# EAGLE design kinesisBLE V5 (EAGLE 9.6.2)
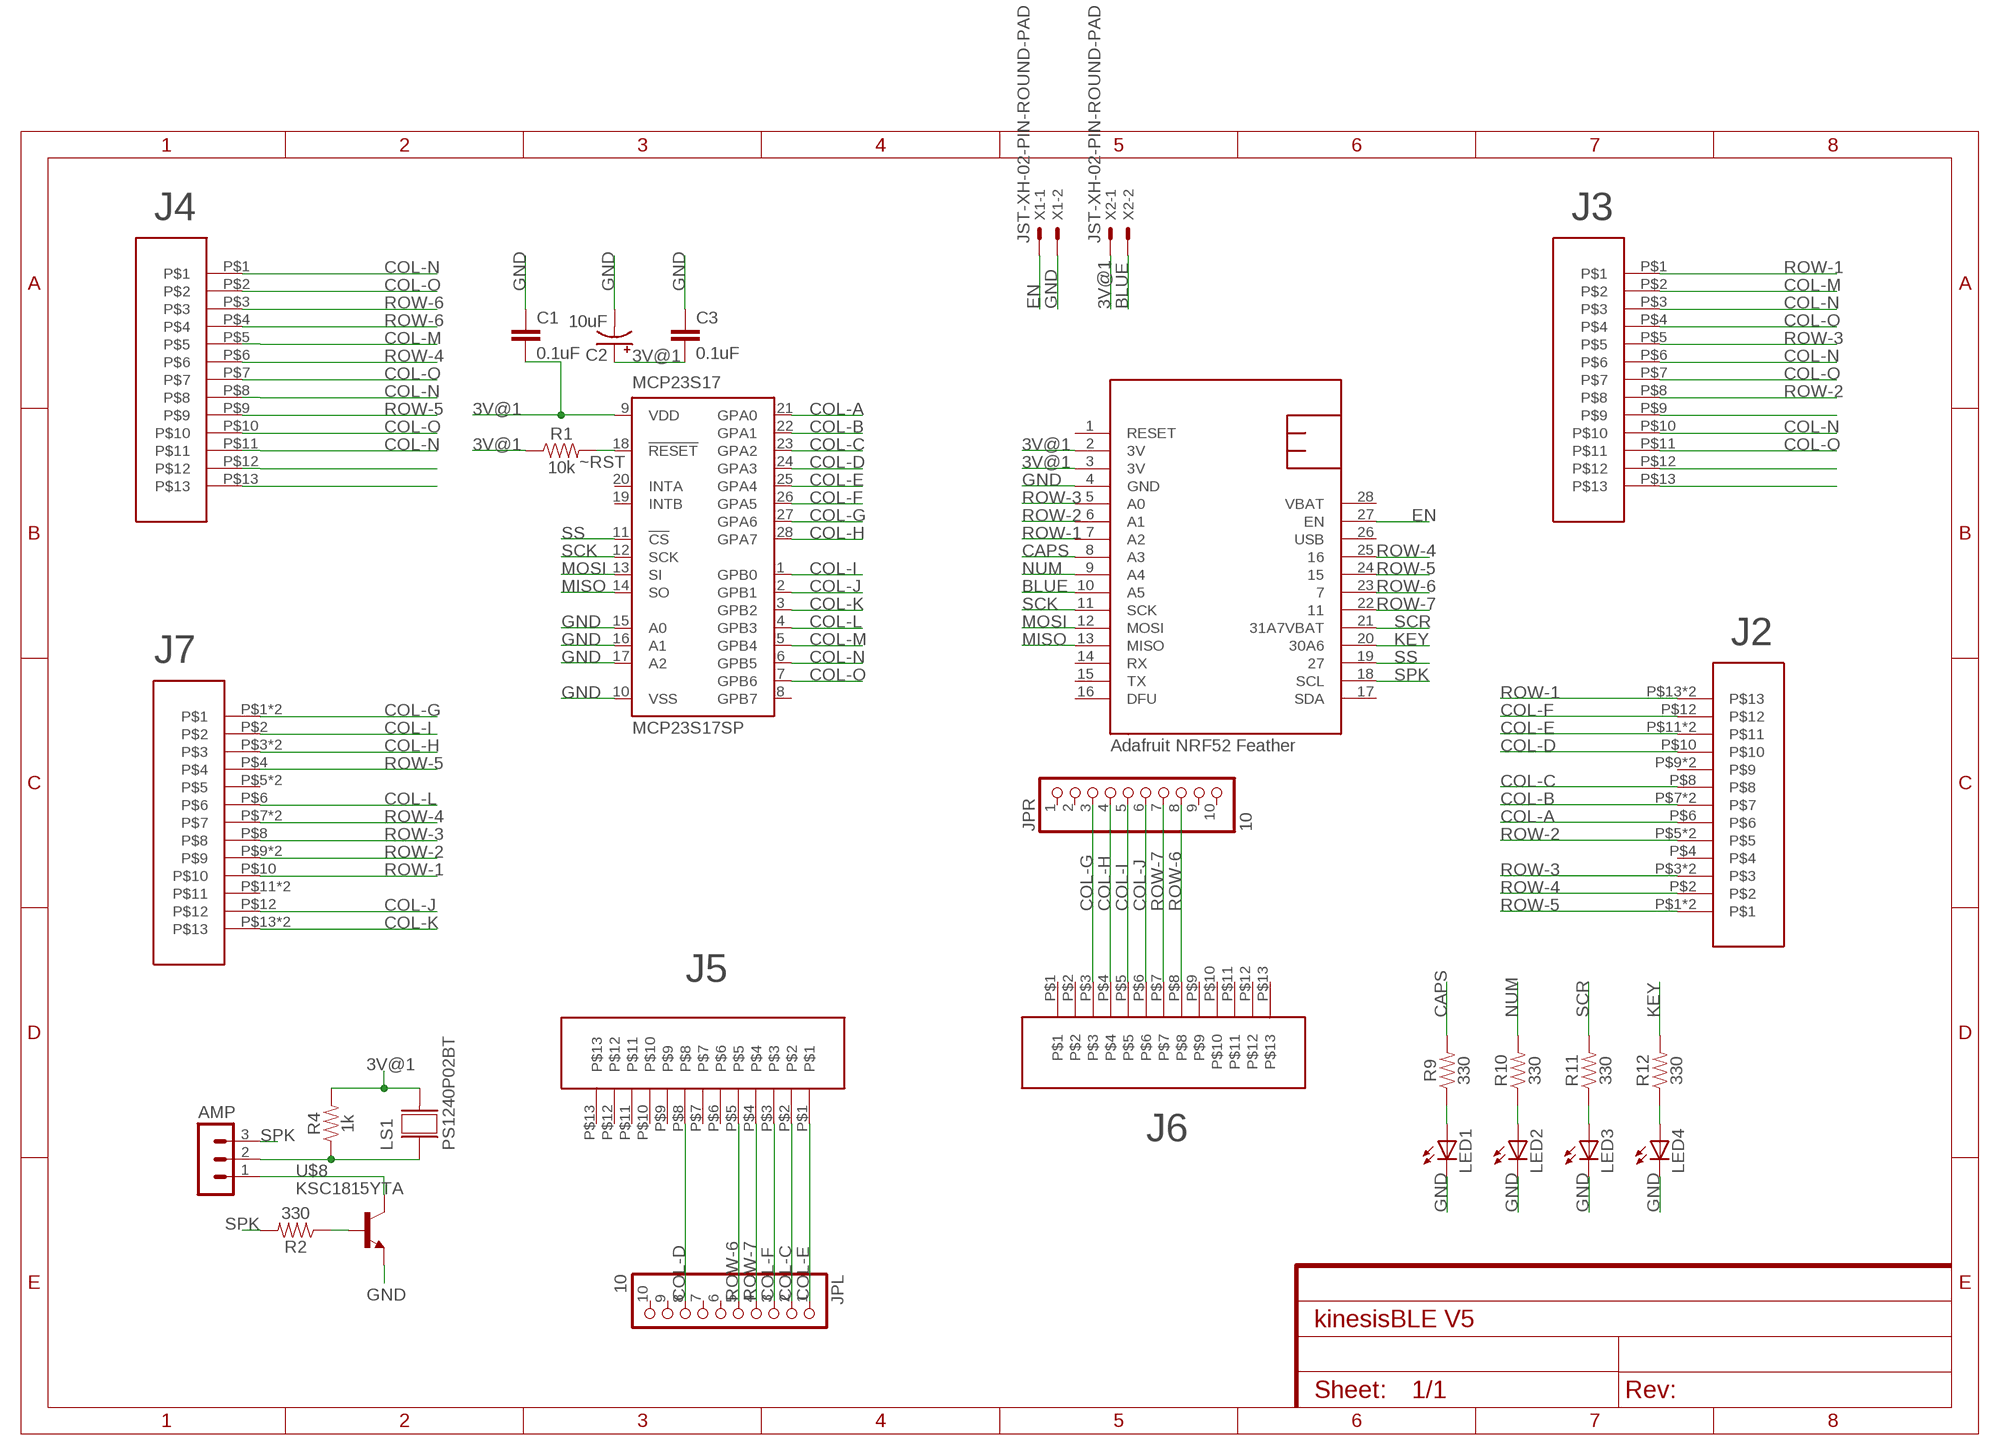
[diagram p0: schematic, sheet 1]

## Parts
AMP  MA03-1  [MA03-1]
C1  0.1uF  0.1UF-KIT-EZ-50V-20%  [CAP-PTH-SMALL-KIT]
C2  10uF  10UF-POLAR-RADIAL-2.5MM-25V-20%  [CPOL-RADIAL-2.5MM-5MM]
C3  0.1uF  0.1UF-KIT-EZ-50V-20%  [CAP-PTH-SMALL-KIT]
JPL  10  PINHD-1X10  [1X10]
JPR  10  PINHD-1X10  [1X10]
LED1  LED3MM  [LED3MM]
LED2  LED3MM  [LED3MM]
LED3  LED3MM  [LED3MM]
LED4  LED3MM  [LED3MM]
LS1  PS1240P02BT  [XDCR_PS1240P02BT]
MCP23S17  MCP23S17SP  [DIL28-3]
R1  10k  10KOHM-HORIZ-1/4W-5%  [AXIAL-0.3]
R2  330  330OHM-HORIZ-1/10W-5%  [AXIAL-0.3]
R4  1k  1KOHM-HORIZ-1/4W-1%  [AXIAL-0.3]
R9  330  330OHM-HORIZ-1/10W-5%  [AXIAL-0.3]
R10  330  330OHM-HORIZ-1/10W-5%  [AXIAL-0.3]
R11  330  330OHM-HORIZ-1/10W-5%  [AXIAL-0.3]
R12  330  330OHM-HORIZ-1/10W-5%  [AXIAL-0.3]
U$1  NRF52FEATHER  [NRF52FEATHER]
U$2  TOPLINKS_STAPELBERG  [TOPLINKS_STAPELBERG]
U$3  TOPLINKS_STAPELBERG  [TOPLINKS_STAPELBERG]
U$4  MOLEX-39-53-215X-DEVMOLEX-39-53-215X-DEV  [MOLEX-39-53-215X-PKG]
U$5  MOLEX-39-53-215X-DEVMOLEX-39-53-215X-DEV  [MOLEX-39-53-215X-PKG]
U$6  TOPLINKS_STAPELBERG  [TOPLINKS_STAPELBERG]
U$7  TOPLINKS_STAPELBERG  [TOPLINKS_STAPELBERG]
U$8  KSC1815YTA  [TO92-ECB]
X1  JST-XH-02-PIN-ROUND-PAD  [JST-XH-02-PACKAGE-ROUND-PAD]
X2  JST-XH-02-PIN-ROUND-PAD  [JST-XH-02-PACKAGE-ROUND-PAD]

## Nets
3V@1 [POWER]: C1.2 C2.1(+) C3.2 LS1.2 MCP23S17.9(VDD) R1.P$1 R4.P$2 U$1.2(3V) U$1.3(3V) X2.1
BLUE: U$1.10(A5) X2.2
CAPS: R9.P$2 U$1.8(A3)
COL-A: MCP23S17.21(GPA0) U$5.P$6
COL-B: MCP23S17.22(GPA1) U$5.P$7 U$5.P$7@2
COL-C: JPL.2 MCP23S17.23(GPA2) U$5.P$8 U$6.P$2
COL-D: JPL.8 MCP23S17.24(GPA3) U$5.P$10 U$6.P$8
COL-E: JPL.1 MCP23S17.25(GPA4) U$5.P$11 U$5.P$11@2 U$6.P$1
COL-F: JPL.3 MCP23S17.26(GPA5) U$5.P$12 U$6.P$3
COL-G: JPR.3 MCP23S17.27(GPA6) U$4.P$1 U$4.P$1@2 U$7.P$3
COL-H: JPR.4 MCP23S17.28(GPA7) U$4.P$3 U$4.P$3@2 U$7.P$4
COL-I: JPR.5 MCP23S17.1(GPB0) U$4.P$2 U$7.P$5
COL-J: JPR.6 MCP23S17.2(GPB1) U$4.P$12 U$7.P$6
COL-K: MCP23S17.3(GPB2) U$4.P$13 U$4.P$13@2
COL-L: MCP23S17.4(GPB3) U$4.P$6
COL-M: MCP23S17.5(GPB4) U$2.P$5 U$3.P$2
COL-N: MCP23S17.6(GPB5) U$2.P$1 U$2.P$8 U$2.P$11 U$3.P$3 U$3.P$6 U$3.P$10
COL-O: MCP23S17.7(GPB6) U$2.P$2 U$2.P$7 U$2.P$10 U$3.P$4 U$3.P$7 U$3.P$11
EN: U$1.27(EN) X1.1
GND [POWER]: C1.1 C2.2(-) C3.1 LED1.K(C) LED2.K(C) LED3.K(C) LED4.K(C) MCP23S17.10(VSS) MCP23S17.15(A0) MCP23S17.16(A1) MCP23S17.17(A2) U$1.4(GND) U$8.E X1.2
KEY: R12.P$2 U$1.20(30A6)
MISO: MCP23S17.14(SO) U$1.13(MISO)
MOSI: MCP23S17.13(SI) U$1.12(MOSI)
N$1: LED1.A R9.P$1
N$2: U$3.P$13
N$3: U$3.P$12
N$4: AMP.1 U$8.C
N$5: AMP.2 LS1.1 R4.P$1
N$6: U$3.P$9
N$7: R2.P$1 U$8.B
N$10: LED2.A R10.P$1
N$11: LED3.A R11.P$1
N$12: LED4.A R12.P$1
N$39: U$2.P$12
N$40: U$2.P$13
NUM: R10.P$2 U$1.9(A4)
ROW-1: U$1.7(A2) U$3.P$1 U$4.P$10 U$5.P$13 U$5.P$13@2
ROW-2: U$1.6(A1) U$3.P$8 U$4.P$9 U$4.P$9@2 U$5.P$5 U$5.P$5@2
ROW-3: U$1.5(A0) U$3.P$5 U$4.P$8 U$5.P$3 U$5.P$3@2
ROW-4: U$1.25 U$2.P$6 U$4.P$7 U$4.P$7@2 U$5.P$2
ROW-5: U$1.24 U$2.P$9 U$4.P$4 U$5.P$1 U$5.P$1@2
ROW-6: JPL.5 JPR.8 U$1.23 U$2.P$3 U$2.P$4 U$6.P$5 U$7.P$8
ROW-7: JPL.4 JPR.7 U$1.22 U$6.P$4 U$7.P$7
SCK: MCP23S17.12(SCK) U$1.11(SCK)
SCR: R11.P$2 U$1.21(31A7VBAT)
SPK: AMP.3 R2.P$2 U$1.18(SCL)
SS: MCP23S17.11(!CS) U$1.19
~RST: MCP23S17.18(!RESET) R1.P$2
Unconnected: JPL.6 JPL.7 JPL.9 JPL.10 JPR.1 JPR.2 JPR.9 JPR.10 MCP23S17.8(GPB7) MCP23S17.19(INTB) MCP23S17.20(INTA) U$1.1(RESET) U$1.14(RX) U$1.15(TX) U$1.16(DFU) U$1.17(SDA) U$1.26(USB) U$4.P$5 U$4.P$5@2 U$4.P$11 U$4.P$11@2 U$5.P$4 U$5.P$9 U$5.P$9@2 U$6.P$6 U$6.P$7 U$6.P$9 U$6.P$10 U$6.P$11 U$6.P$12 U$6.P$13 U$7.P$1 U$7.P$2 U$7.P$9 U$7.P$10 U$7.P$11 U$7.P$12 U$7.P$13

## Notes on the sheet
- J4 | J3
- J2
- J7
- Adafruit NRF52 Feather
- J5
- J6

## Power pins joined to a net without a drawn wire
VBAT: U$1.28(VBAT)

## Library data of the parts
AMP = con-lstb:MA03-1: PIN HEADER; OC_FARNELL: unknown; OC_NEWARK: unknown
C1 C3 = SparkFun-Capacitors:0.1UF: 0.1µF ceramic capacitors A capacitor is a passive two-terminal electrical component used to store electrical energy temporarily in an electric field.; PROD_ID: CAP-08370
C2 = SparkFun-Capacitors:10UF-POLAR: 10.0µF polarized capacitors A capacitor is a passive two-terminal electrical component used to store electrical energy temporarily in an electric field.; PROD_ID: CAP-08440
JPL JPR = pinhead:PINHD-1X10: PIN HEADER
LED1-LED4 = adafruit:LED: LED OSRAM: - CHIPLED LG R971, LG N971, LY N971, LG Q971, LY Q971, LO R971, LY R971 LH N974, LH R974 LS Q976, LO Q976, LY Q976 LO Q996 - Hyper CHIPLED LW Q18S LB Q993, LB Q99A, LB R99A - SideLED LS A670, LO A670, LY A670, LG A670, LP A670 LB A673, LV A673, LT A673, LW A673 LH A674 LY A675 LS A676, LA A676, LO A676, LY A676, LW A676 LS A679, LY A679, LG A679 - Hyper Micro SIDELED® LS Y876, LA Y876, LO Y876, LY Y876 LT Y87S - SmartLED LW L88C, LW L88S LB L89C, LB L89S, LG L890 LS L89K, LO L89K, LY L89K LS L896, LA L896, LO L896, LY L896 - TOPLED LS T670, LO T670, LY T670, LG T670, LP T670 LSG T670, LSP T670, LSY T670, LOP T670, LYG T670 LG T671, LOG T671, LSG T671 LB T673, LV T673, LT T673, LW T673 LH T674 LS T676, LA T676, LO T676, LY T676, LB T676, LH T676, LSB T676, LW T676 LB T67C, LV T67C, LT T67C, LS T67K, LO T67K, LY T67K, LW E67C LS E67B, LA E67B, LO E67B, LY E67B, LB E67C, LV E67C, LT E67C LW T67C LS T679, LY T679, LG T679 LS T770, LO T770, LY T770, LG T770, LP T770 LB T773, LV T773, LT T773, LW T773 LH T774 LS E675, LA E675, LY E675, LS T675 LS T776, LA T776, LO T776, LY T776, LB T776 LHGB T686 LT T68C, LB T68C - Hyper Mini TOPLED® LB M676 - Mini TOPLED Santana® LG M470 LS M47K, LO M47K, LY M47K Source: http://www.osram.convergy.de/
LS1 = PS1240P02BT:PS1240P02BT: Buzzers Transducer, Externally Driven Piezo 3V 4kHz 60dB @ 3V, 10cm Through Hole PC Pins; AVAILABILITY: Unavailable; DESCRIPTION: Buzzers Transducer, Externally Driven Piezo 3V 4kHz 60dB @ 3V, 10cm Through Hole PC Pins; MF: TDK; MP: PS1240P02BT; PACKAGE: None; PRICE: None
MCP23S17 = microchip:MCP23S17: http://ww1.microchip.com/downloads/en/DeviceDoc/21952a.pdf Source: http://ww1.microchip.com/downloads/en/DeviceDoc/21952a.pdf; MF: MICROCHIP; MPN: MCP23S17-E/SP; OC_FARNELL: 1292238; OC_NEWARK: 31K2951
R1 = SparkFun-Resistors:10KOHM: 10kΩ resistor A resistor is a passive two-terminal electrical component that implements electrical resistance as a circuit element. Resistors act to reduce current flow, and, at the same time, act to lower voltage levels within circuits. - Wikipedia; PROD_ID: RES-09435
R2 R9-R12 = SparkFun-Resistors:330OHM: 330Ω resistor A resistor is a passive two-terminal electrical component that implements electrical resistance as a circuit element. Resistors act to reduce current flow, and, at the same time, act to lower voltage levels within circuits. - Wikipedia; PROD_ID: RES-8371
R4 = SparkFun-Resistors:1KOHM: 1kΩ resistor A resistor is a passive two-terminal electrical component that implements electrical resistance as a circuit element. Resistors act to reduce current flow, and, at the same time, act to lower voltage levels within circuits. - Wikipedia; PROD_ID: RES-12182
U$1 = mike:NRF52FEATHER
U$2 U$3 U$6 U$7 = con-molex-39-53:TOPLINKS_STAPELBERG
U$4 U$5 = nspringkeeb:MOLEX-39-53-215X-DEV: 13 pin footprint for right angle (39-53-2154) or straight (39-53-2155) ribbon connectors
U$8 = nspringkeeb:KSC1815YTA: NPN TO-92 Kinked
X1 X2 = Rembrandt Electronics - JST XH Connectors v1-0:JST-XH-02-PIN: JST XH Connector 2 Pin Wire to board connector. Pitch: 2,54 mm, (0.100") Number of pins: 2 Created by Rembrandt Electronics www.rembrandtelectronics.com

## Net classes
0 default: width 0.203 mm
1 POWER: width 0.406 mm

## Board
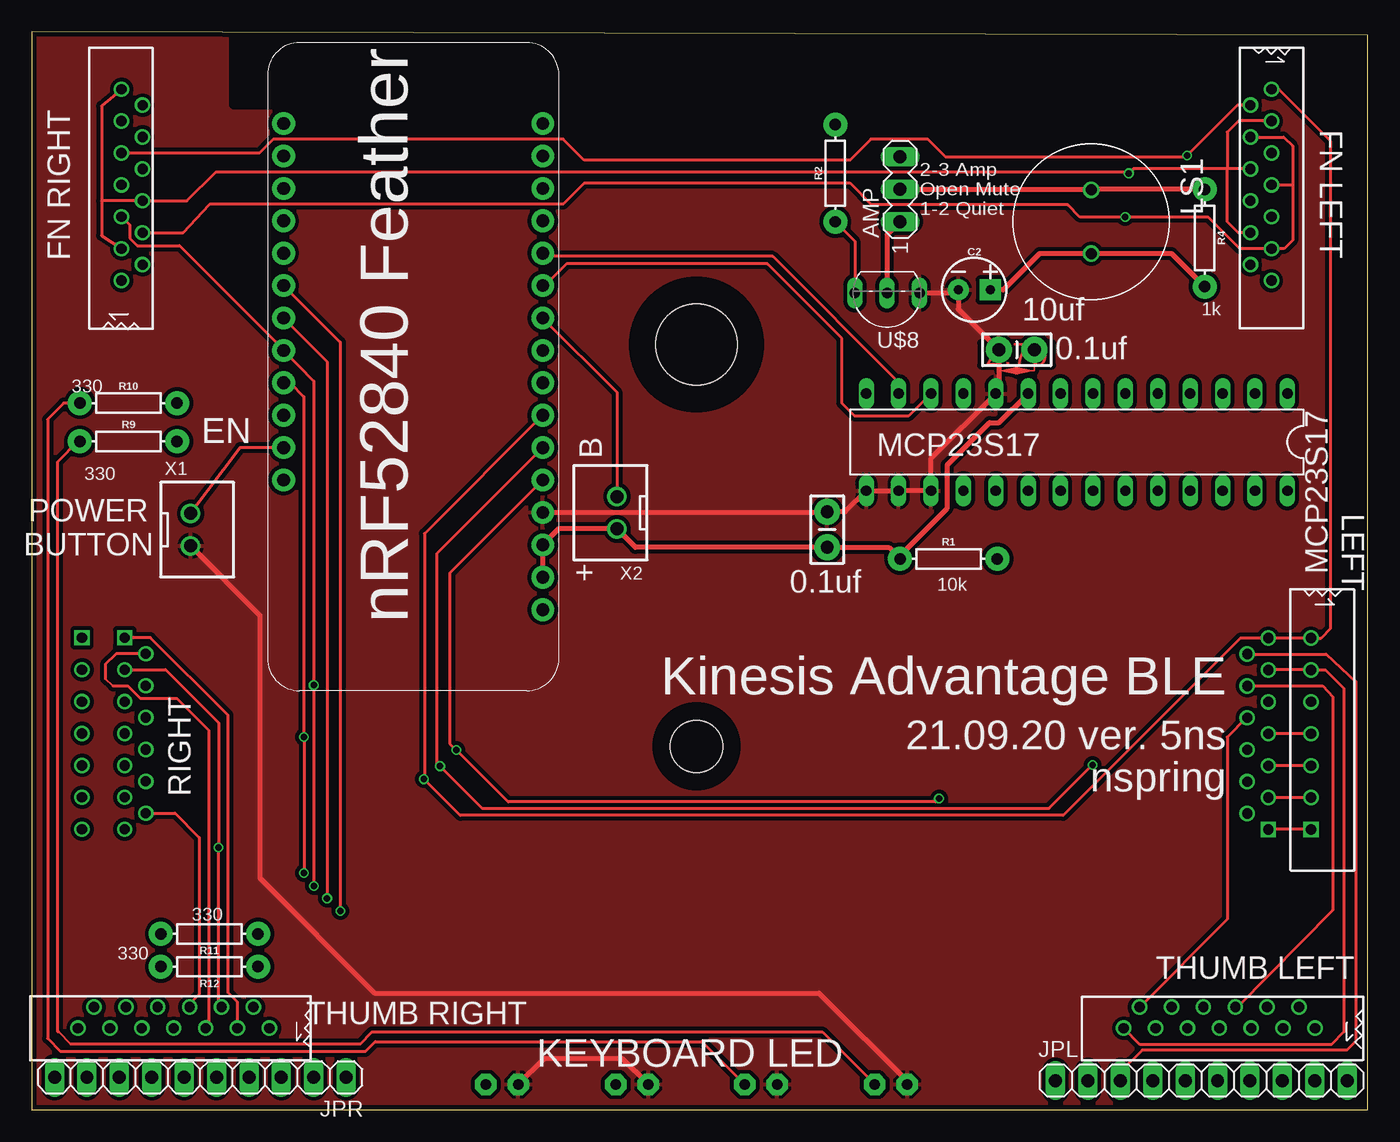
[diagram p1: board, top side]
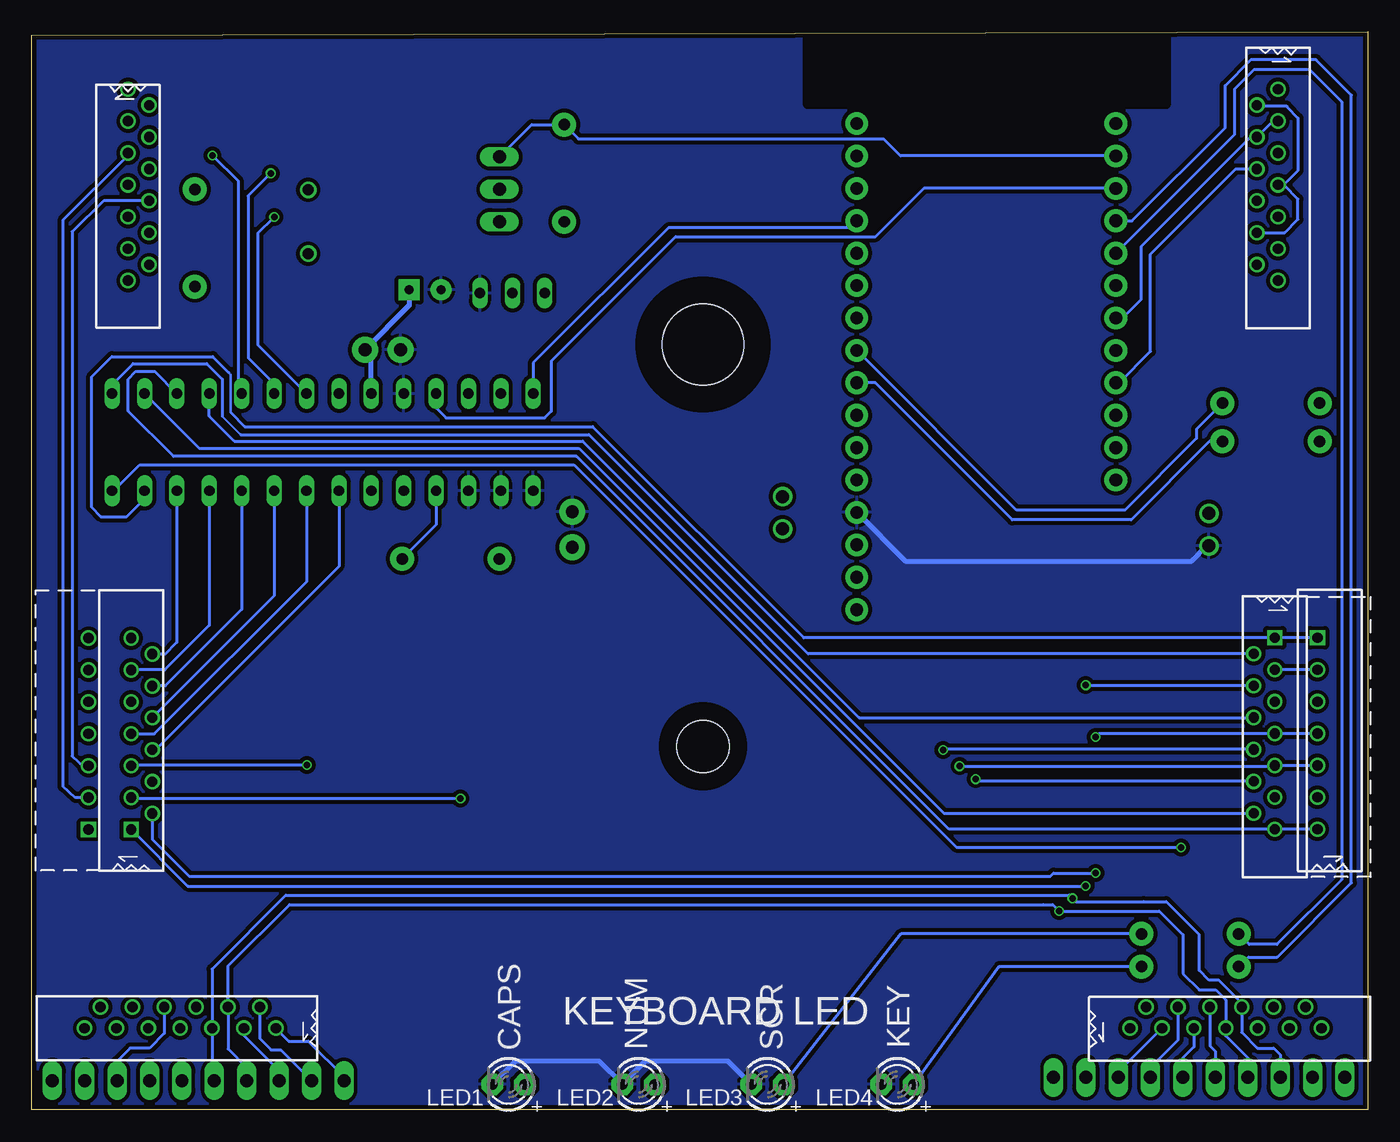
[diagram p2: board, bottom side, seen from below]

Size 104.73 x 84.48 mm. Coordinates in mm from the lower left corner, seen from the top.
Outline: 0,0 104.73,0 104.73,84.22 0,84.48 0,0
Copper layers (1*16): Top 0.035559375mm / dielectric 1.6mm / Bottom 0.035559375mm
Design rules "oshpark-2layer": minimum track width 6mil, minimum drill 10mil, track to track 6mil, track to pad 6mil, pad to pad 6mil, via to via 6mil, smd to smd 6mil, copper to edge 15mil, drill to drill 6mil, minimum pad ring 5mil, minimum via ring 5mil, stop-mask expansion 2.5mil, vias tented up to drill 0mil, thermal gap 10mil
Holes 6.4 mm at 52.11,59.98
Holes 4.1 mm at 52.11,28.48
tKeepout: area 47.1,55 to 57.1,65; area 49.5,25.8 to 54.8,31.1; area 15.7,79 to 43.9,84.6
bKeepout: area 47.1,55 to 57.1,65; area 49.5,25.8 to 54.8,31.1; area 15.7,78.7 to 43.9,84.3
tRestrict: area 47.1,55 to 57.1,65; area 49.5,25.8 to 54.8,31.1; area 15.7,78.7 to 43.9,84.3
bRestrict: area 47.1,55 to 57.1,65; area 49.5,25.8 to 54.8,31.1; area 15.7,78.7 to 43.9,84.3
vRestrict: area 47.1,55 to 57.1,65; area 49.5,25.8 to 54.8,31.1; area 15.7,78.7 to 43.9,84.3

### Footprints (pad centres in the part's own frame; a part is rotated, then mirrored left to right if it is on the bottom)
MA03-1 = drill 1.016 long: 1 -2.54,0; 2 0,0; 3 2.54,0
CAP-PTH-SMALL-KIT = drill 1.016 pad 2.032: 1 -1.397,0; 2 1.397,0
CPOL-RADIAL-2.5MM-5MM = drill 0.7 pad 1.651 square: 1 1.25,0 | drill 0.7 pad 1.651: 2 -1.25,0
1X10 = drill 1.016 long: 1 -11.43,0; 2 -8.89,0; 3 -6.35,0; 4 -3.81,0; 5 -1.27,0; 6 1.27,0; 7 3.81,0; 8 6.35,0; 9 8.89,0; 10 11.43,0
LED3MM = drill 0.813 pad 1.676 octagon: A -1.27,0; K 1.27,0
XDCR_PS1240P02BT = drill 0.85 pad 1.28: 1 -2.5,0; 2 2.5,0
DIL28-3 = drill 0.813 long: 1 -16.51,-3.81; 2 -13.97,-3.81; 3 -11.43,-3.81; 4 -8.89,-3.81; 5 -6.35,-3.81; 6 -3.81,-3.81; 7 -1.27,-3.81; 8 1.27,-3.81; 9 3.81,-3.81; 10 6.35,-3.81; 11 8.89,-3.81; 12 11.43,-3.81; 13 13.97,-3.81; 14 16.51,-3.81; 15 16.51,3.81; 16 13.97,3.81; 17 11.43,3.81; 18 8.89,3.81; 19 6.35,3.81; 20 3.81,3.81; 21 1.27,3.81; 22 -1.27,3.81; 23 -3.81,3.81; 24 -6.35,3.81; 25 -8.89,3.81; 26 -11.43,3.81; 27 -13.97,3.81; 28 -16.51,3.81
AXIAL-0.3 = drill 0.9 pad 1.88: P$1 -3.81,0; P$2 3.81,0
NRF52FEATHER = drill 1 pad 1.778: 1 -17.78,-10.16; 2 -15.24,-10.16; 3 -12.7,-10.16; 4 -10.16,-10.16; 5 -7.62,-10.16; 6 -5.08,-10.16; 7 -2.54,-10.16; 8 0,-10.16; 9 2.54,-10.16; 10 5.08,-10.16; 11 7.62,-10.16; 12 10.16,-10.16; 13 12.7,-10.16; 14 15.24,-10.16; 15 17.78,-10.16; 16 20.32,-10.16; 17 20.32,10.16; 18 17.78,10.16; 19 15.24,10.16; 20 12.7,10.16; 21 10.16,10.16; 22 7.62,10.16; 23 5.08,10.16; 24 2.54,10.16; 25 0,10.16; 26 -2.54,10.16; 27 -5.08,10.16; 28 -7.62,10.16
TOPLINKS_STAPELBERG = drill 0.8: P$1 -0.08,7.51; P$2 1.57,6.26; P$3 -0.08,5.01; P$4 1.57,3.76; P$5 -0.08,2.51; P$6 1.57,1.26; P$7 -0.08,0.01; P$8 1.57,-1.24; P$9 -0.08,-2.49; P$10 1.57,-3.74; P$11 -0.08,-4.99; P$12 1.57,-6.24; P$13 -0.08,-7.49
MOLEX-39-53-215X-PKG = drill 0.8 square: P$1 -0.08,7.51; P$1@2 -3.43,7.51 | drill 0.8: P$2 1.57,6.26; P$3 -0.08,5.01; P$3@2 -3.43,5.01; P$4 1.57,3.76; P$5 -0.08,2.51; P$5@2 -3.43,2.51; P$6 1.57,1.26; P$7 -0.08,0.01; P$7@2 -3.43,0.01; P$8 1.57,-1.24; P$9 -0.08,-2.49; P$9@2 -3.43,-2.49; P$10 1.57,-3.74; P$11 -0.08,-4.99; P$11@2 -3.43,-4.99; P$12 1.57,-6.24; P$13 -0.08,-7.49; P$13@2 -3.43,-7.49
TO92-ECB = drill 0.813 long: B 2.54,0; C 0,0; E -2.54,0
JST-XH-02-PACKAGE-ROUND-PAD = drill 1.016: 1 -1.27,0; 2 1.27,0

### Placement (x,y rotation side)
AMP  68.07,72.14 90 top
C1  77.22,59.56 0 top
C2  73.89,64.26 0 top
C3  62.36,45.47 270 top
JPL  91.69,2.29 0 top
JPR  13.21,2.54 180 top
LED1  67.36,1.98 180 bottom
LED2  57.16,1.98 180 bottom
LED3  47.06,1.98 180 bottom
LED4  36.86,1.98 180 bottom
LS1  83.06,69.6 270 top
MCP23S17  81.93,52.32 180 top
R1  71.88,43.18 0 top
R2  62.99,73.41 90 top
R4  91.95,68.33 270 top
R9  7.57,52.37 0 top
R10  7.57,55.38 0 top
R11  13.92,13.79 180 top
R12  13.92,11.21 180 top
U$1  29.9,56.97 90 top
U$2  7.11,72.48 0 top
U$3  97.11,72.48 0 bottom
U$4  7.36,29.48 0 top
U$5  96.86,29.48 180 top
U$6  93.11,6.48 90 top
U$7  11.11,6.48 90 bottom
U$8  67.06,64.01 180 top
X1  12.45,45.47 270 top
X2  45.87,46.79 90 top

### Tracks (layer width: path | path; a pad name or v marks a point on that pad's centre or on a via)
3V@1
  Top 0.406: MCP23S17.9 75.83,53.85 75.08,53.85 71.78,50.55 71.78,47.14 68.07,43.43 R1.P$1 67.18,44.07 C3.2 47.32,44.07 X2.1 41.3,45.52 U$1.3 U$1.2 | C2.1 76.16,64.26 78.99,67.1 LS1.2 89.37,67.1 R4.P$2
  Bottom 0.406: MCP23S17.9 78.12,59.07 C1.2 75.14,63.04 C2.1
BLUE
  Top 0.254: U$1.10 45.87,56.23 X2.2
CAPS
  Bottom 0.254: U$1.8 38.61,56.97 27.87,46.23 18.54,46.23 12.4,52.37 R9.P$2
COL-A
  Bottom 0.254: MCP23S17.21 80.66,42.59 95.03,28.22 U$5.P$6
COL-B
  Top 0.254: U$5.P$7@2 U$5.P$7
  Bottom 0.254: U$5.P$7 96.92,29.45 95.12,29.45 83.2,41.38 MCP23S17.22
COL-C
  Top 0.254: U$6.P$2 93.73,14.92 93.73,29.21 95.23,30.72 U$5.P$8
  Bottom 0.254: JPL.2 85.22,4.7 85.98,4.7 86.87,5.59 86.87,6.31 86.85,6.33 U$6.P$2 | MCP23S17.23 85.74,40.26 U$5.P$8
COL-D
  Top 0.254: U$6.P$8 94.5,8.05 101.98,15.65 101.98,32.38 101.21,33.22 U$5.P$10
  Bottom 0.254: U$6.P$8 94.35,5.98 95.5,4.83 97.03,4.83 98.04,3.81 JPL.8 | MCP23S17.24 88.28,39.21 94.27,33.22 U$5.P$10
COL-E
  Top 0.254: U$5.P$11 U$5.P$11@2 101.42,34.47 102.87,33.02 102.87,6.1 101.88,5.11 86.89,5.11 U$6.P$1
  Bottom 0.254: JPL.1 80.26,2.58 83.06,5.38 84.58,5.38 U$6.P$1 | MCP23S17.25 90.82,37.96 94.31,34.47 U$5.P$11
COL-F
  Top 0.254: U$5.P$12 101.47,35.72 103.81,33.56 103.81,5.37 103.11,4.68 87.06,4.68 85.34,2.96 JPL.3
  Bottom 0.254: JPL.3 85.34,3.05 88.1,5.8 U$6.P$3 | MCP23S17.26 93.36,36.63 94.27,35.72 U$5.P$12
COL-G
  Top 0.254: U$7.P$3 16.12,8.43 15.36,9.19 15.36,30.94 9.29,37 7.3,37 U$4.P$1
  Bottom 0.203: 89.29,57.77 89.14,57.62 89.14,54.66
  Bottom 0.254: U$4.P$1@2 U$4.P$1 44.2,36.99 60.76,53.55 88.03,53.55 89.14,54.66 | 89.29,57.77 90.55,59.03 98.45,59.03 100.08,57.4 100.08,47.24 99.31,46.48 97.28,46.48 95.9,47.87 MCP23S17.27 | U$7.P$3 19.56,2.96 JPR.3
COL-H  (via drill 0.51)
  Top 0.254: U$7.P$4 14.62,8.3 14.62,20.53 v14.63,20.55 14.63,30.33 10.47,34.49 U$4.P$3
  Bottom 0.254: U$4.P$3@2 U$4.P$3 | MCP23S17.28 98.3,48.51 96.27,50.55 62.23,50.55 32.26,20.57 14.66,20.57 v14.63,20.55 | U$7.P$4 14.87,5.45 17.02,3.3 JPR.4
COL-I
  Top 0.203: 5.77,33.78 6.33,33.22 6.35,33.22
  Top 0.254: 5.77,33.78 5.77,34.9 6.61,35.75 8.92,35.75 U$4.P$2 | 6.35,33.22 7.52,33.22 8.52,32.23 11.38,32.23 13.87,29.73 13.87,6.65 U$7.P$5
  Bottom 0.203: 89.8,54.36 88.36,52.91
  Bottom 0.254: U$4.P$2 43.88,35.74 61.05,52.91 88.36,52.91 | MCP23S17.1 98.44,56.82 96.79,58.47 91.01,58.47 89.8,57.27 89.8,54.36 | U$7.P$5 13.62,4.92 14.48,4.06 JPR.5
COL-J
  Top 0.254: U$4.P$12 11.22,23.24 13.13,21.32 13.13,9.06 12.37,8.3 U$7.P$6
  Bottom 0.254: MCP23S17.2 91.6,51.84 61.83,51.84 33.23,23.24 U$4.P$12 | U$7.P$6 12.37,5 11.94,4.57 JPR.6
COL-K
  Bottom 0.254: U$4.P$13@2 U$4.P$13 32.81,21.99 62.03,51.21 93.63,51.21 97.17,54.75 97.17,57.27 96.57,57.86 95.08,57.86 MCP23S17.3
COL-L
  Bottom 0.254: MCP23S17.4 90.82,54.36 88.86,52.4 61.54,52.4 39.88,30.74 U$4.P$6
COL-M  (via drill 0.51)
  Top 0.254: U$3.P$2 94.52,78.74 v90.58,74.8 90.46,74.68 71.63,74.68 70.24,76.07 65.79,76.07 64.14,74.42 43.3,74.42 41.66,76.07 18.92,76.07 17.84,74.99 U$2.P$5
  Bottom 0.254: MCP23S17.5 88.53,56.39 88.53,72.75 v90.58,74.8
COL-N  (via drill 0.51)
  Top 0.254: U$2.P$1 5.46,78.68 5.46,71.23 | 5.46,71.23 5.46,68.52 U$2.P$11 | 5.46,71.23 U$2.P$8 12.16,71.24 14.39,73.47 85.93,73.47 v86,73.4 86.34,73.74 93.73,73.74 | U$3.P$6 93.73,73.74 | U$3.P$3 97.18,77.5 94.61,77.5 93.73,76.61 93.73,73.74 | 93.73,73.74 93.73,69.6 94.59,68.74 U$3.P$10
  Bottom 0.254: MCP23S17.6 85.74,56.9 87.77,58.93 87.77,68.8 87.78,71.62 v86,73.4
COL-O  (via drill 0.51)
  Top 0.254: U$3.P$4 98.16,76.24 98.85,75.54 98.85,72.49 | U$3.P$7 98.85,72.49 | U$2.P$10 11.86,68.74 13.94,70.98 41.66,70.98 43.32,72.64 64.12,72.64 65.84,70.92 81.21,70.92 82.17,69.96 v85.72,69.96 92.22,69.96 94.7,67.49 U$3.P$11 98.19,67.49 98.85,68.14 98.85,72.49
  Bottom 0.254: U$2.P$2 8.62,78.68 6.35,78.68 6.35,78.61 5.46,77.72 5.46,73.6 6.57,72.49 U$2.P$7 6.57,72.49 5.46,71.37 5.46,69.79 6.51,68.74 U$2.P$10 | MCP23S17.7 87.01,59.94 87.01,68.68 v85.72,69.96
EN
  Top 0.254: U$1.27 16.32,51.89 X1.1
GND
  Top 0.406: U$1.4 62.3,46.81 C3.1 63.77,46.86 MCP23S17.15 MCP23S17.16 MCP23S17.17 70.5,51.05 MCP23S17.10 75.82,56.38 C1.1 72.64,62.74 C2.2 72.39,64.01 U$8.E | X1.2 17.87,38.77 17.87,18.16 26.89,9.14 61.72,9.14 68.83,2.03 68.72,1.92 LED1.K | LED4.K 40.16,4.01 46.3,4.01 LED3.K
  Bottom 0.406: U$1.4 36.25,43 13.79,43 12.59,44.2 X1.2 | LED3.K 50.16,3.81 56.64,3.81 58.43,2.02 LED2.K 60.26,3.81 66.8,3.81 LED1.K
  pour Top (isolate 0.305): 0,84.48 104.73,84.48 104.73,0 0,0
  pour Bottom (isolate 0.305): 0,84.48 104.73,84.48 104.73,0 0,0
KEY
  Bottom 0.254: U$1.20 18.47,69.67 11.18,76.96 11.18,80.26 9.14,82.3 4.05,82.3 1.27,79.52 1.27,17.78 7.08,11.97 9.35,11.97 R12.P$2
MISO
  Bottom 0.254: U$1.13 40.56,69.16 54.79,69.16 65.42,58.53 MCP23S17.14
MOSI
  Top 0.254: U$1.12 40.31,66.88 58.09,66.88 67.96,57.01 MCP23S17.13
N$1
  Top 0.203: 3.05,5.15 2.1,6.1 2.03,6.1
  Top 0.254: R9.P$1 3.61,52.37 2.03,50.8 2.03,6.1 | 3.05,5.15 25.72,5.15 26.67,6.1 61.98,6.1 LED1.A
N$4
  Top 0.406: AMP.1 67.06,68.58 U$8.C
N$5
  Top 0.254: 83.02,72.14 LS1.1
  Top 0.406: AMP.2 83.02,72.14 R4.P$1
N$7
  Top 0.254: R2.P$1 64.52,68.07 U$8.B
N$10
  Top 0.254: LED2.A 52.53,5.33 26.92,5.33 26.16,4.57 2.24,4.57 1.22,5.59 1.22,54.11 2.49,55.38 R10.P$1
N$11
  Bottom 0.254: R11.P$1 36.58,13.79 LED3.A
N$12
  Bottom 0.254: R12.P$1 28.9,11.21 LED4.A
NUM
  Bottom 0.254: U$1.9 27.54,46.99 19.05,46.99 13.42,52.62 13.42,53.35 R10.P$2
ROW-1  (via drill 0.51)
  Top 0.254: U$1.7 30.79,45.16 30.79,25.96 v30.73,25.91 33.58,23.06 80.86,23.06 94.76,36.97 U$5.P$13 U$5.P$13@2 101.08,36.97 101.8,37.69 101.8,75.95 97.76,79.99 U$3.P$1
  Bottom 0.254: U$4.P$10 30.56,25.74 v30.73,25.91
ROW-2  (via drill 0.51)
  Top 0.254: U$1.6 31.75,43.58 31.75,27.18 v32,26.92 35.31,23.62 79.76,23.62 v83.16,27.03 | U$5.P$5@2 U$5.P$5
  Bottom 0.254: U$3.P$8 99.11,71.24 101.57,68.81 101.57,27.72 101.14,27.31 100.79,26.97 U$5.P$5@2 | v32,26.92 7.35,26.92 U$4.P$9 U$4.P$9@2 | U$5.P$5 96.88,27.03 v83.16,27.03
ROW-3  (via drill 0.51)
  Top 0.254: U$1.5 32.77,42.06 32.77,28.7 v33.27,28.19 37.34,24.13 70.87,24.13 v71.12,24.38 | U$5.P$3@2 U$5.P$3
  Bottom 0.254: U$4.P$8 33.23,28.24 v33.27,28.19 | U$5.P$3@2 101.32,24.47 102.31,25.35 102.31,69.71 97.19,74.82 U$3.P$5 | v71.12,24.38 96.85,24.38 U$5.P$3
ROW-4  (via drill 0.51)
  Top 0.254: U$1.25 20.26,56.97 21.33,55.89 21.33,29.22 v21.34,29.21 v21.34,18.55 v21.33,18.54
  Bottom 0.254: v21.33,18.54 24.63,18.54 24.88,18.29 92.39,18.29 95.29,21.18 U$5.P$2 | U$1.25 19.48,56.97 17.02,59.44 17.02,67.06 10.34,73.74 U$2.P$6 | U$4.P$7@2 U$4.P$7 21.06,29.49 v21.34,29.21
ROW-5  (via drill 0.51)
  Top 0.254: v22.11,33.29 22.11,57.1 U$1.24 19.74,59.57 11.58,67.73 8.26,67.73 7.67,68.32 7.67,69.35 U$2.P$9 | v22.11,33.29 v22.11,17.53 | U$5.P$1@2 U$5.P$1 | v22.1,33.27 v22.11,33.29
  Bottom 0.254: U$4.P$4 22.06,33.24 v22.1,33.27 | U$5.P$1 92.5,17.53 v22.11,17.53
ROW-6  (via drill 0.51)
  Top 0.254: U$1.23 23.15,58.63 v23.15,16.57
  Bottom 0.254: U$2.P$3 7.43,77.49 U$2.P$4 9.19,76.24 17.78,67.64 17.78,63.5 19.23,62.05 U$1.23 | JPL.5 90.6,2.46 U$6.P$5 90.61,11.02 84.82,16.82 23.4,16.82 v23.15,16.57 22.89,16.31 17.55,16.31 15.8,16.31 13.21,13.72 13.21,10.92 12.45,10.16 11.68,10.16 9.87,8.35 U$7.P$8 9.87,6.06 8.64,4.83 7.37,4.83 6.86,4.32 JPR.8
ROW-7  (via drill 0.51)
  Top 0.254: U$1.22 24.19,60.16 v24.19,15.57
  Bottom 0.254: JPL.4 87.88,3.3 89.35,4.77 U$6.P$4 89.35,11.27 84.53,16.07 25.46,16.08 24.69,16.08 v24.19,15.57 16.33,15.57 14.48,13.72 14.48,10.67 13.21,9.4 11.91,9.4 11.12,8.61 U$7.P$7 11.12,5.79 9.4,4.06 JPR.7
SCK
  Top 0.254: MCP23S17.12 68.72,54.36 64.52,54.36 63.5,55.37 63.5,60.45 57.66,66.29 41.91,66.29 40.21,64.59 U$1.11
SCR
  Bottom 0.254: U$1.21 10.41,76.45 10.41,80.01 8.89,81.53 4.57,81.53 2.03,78.99 2.03,18.03 7.11,12.95 9.28,12.95 R11.P$2
SPK
  Bottom 0.254: U$1.18 36.63,74.75 37.97,76.1 61.87,76.1 R2.P$2 65.53,77.22 AMP.3
SS
  Bottom 0.254: U$1.19 34.8,72.21 38.58,68.43 54.25,68.43 64.01,58.67 64.01,54.74 64.52,54.23 72.27,54.23 73.04,55 MCP23S17.11
~RST
  Bottom 0.254: MCP23S17.18 73.04,45.83 R1.P$2
(copper drawn outside any net)
  shapes: Top area x1

### Text on the board
tPlace: FN RIGHT | FN LEFT | 2-3 Amp / Open Mute / 1-2 Quiet | 10uf | 1k | 0.1uf | 330 | EN | MCP23S17 | B | 330 | POWER / BUTTON | LEFT | + | 0.1uf | 10k | nRF52840 Feather | Kinesis Advantage BLE | RIGHT | 21.09.20 ver. 5ns | nspring | 330 | 330 | THUMB LEFT | THUMB RIGHT | KEYBOARD LED
bPlace: CAPS | KEY | SCR | KEYBOARD LED | NUM